# Altium schematic sheet Top_Sheet.SchDoc
size 420 x 297 mm; SheetNumber: 1; SheetTotal: 4
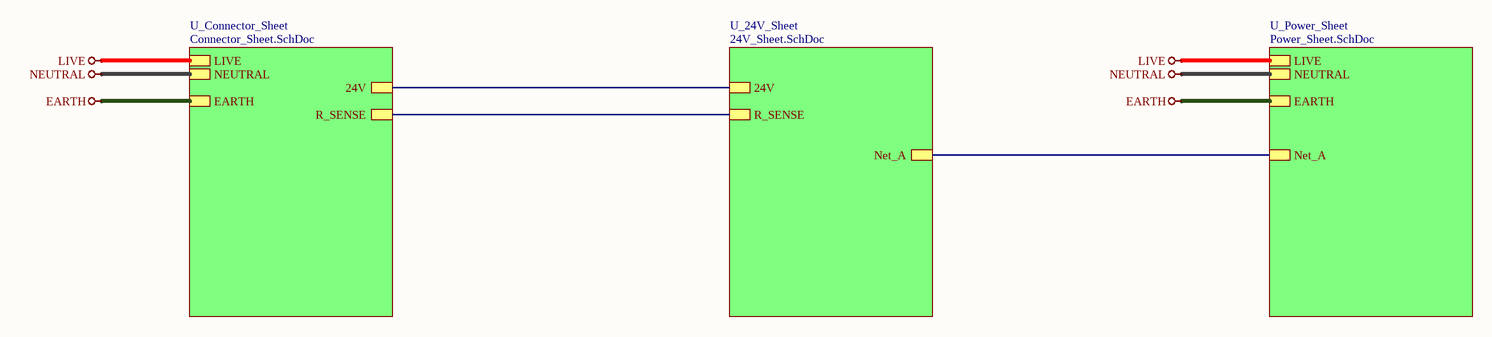
[diagram p0: Top_Sheet.SchDoc]

## Sub-sheets
U_24V_Sheet = 24V_Sheet.SchDoc: 24V, R_SENSE, Net_A
U_Connector_Sheet = Connector_Sheet.SchDoc: LIVE, EARTH, NEUTRAL, 24V, R_SENSE
U_Power_Sheet = Power_Sheet.SchDoc: LIVE, EARTH, NEUTRAL, Net_A

## Nets
EARTH: sheet U_Connector_Sheet/EARTH, sheet U_Power_Sheet/EARTH
LIVE: sheet U_Connector_Sheet/LIVE, sheet U_Power_Sheet/LIVE
NEUTRAL: sheet U_Connector_Sheet/NEUTRAL, sheet U_Power_Sheet/NEUTRAL
(unnamed): sheet U_24V_Sheet/24V, sheet U_Connector_Sheet/24V
(unnamed): sheet U_24V_Sheet/R_SENSE, sheet U_Connector_Sheet/R_SENSE
(unnamed): sheet U_24V_Sheet/Net_A, sheet U_Power_Sheet/Net_A

## Notes on the sheet
- File:
- Title:
- Date:
- Page
- Num:
- Total:
- Drawn By: Huzaifa Ali